# Altium project ad_Simu_Test.PrjPCB
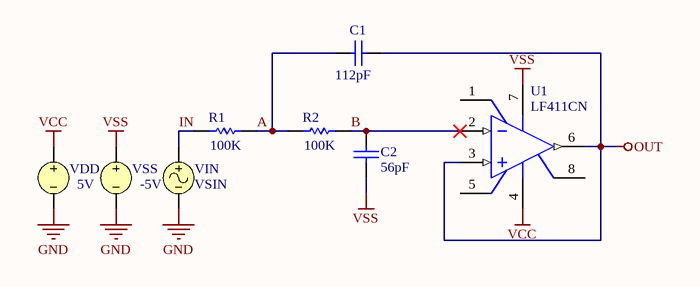
[diagram p0: ad_Simu_Test.SchDoc]
1 sheet, 8 parts. Net scope: global (net labels, ports and power ports of the same name join across sheets).

## Sheet ad_Simu_Test.SchDoc
size A4

### Parts
C1  value 112pF  [1608[0603]]  (hidden comment: Cap Semi)
C2  value 56pF  [1608[0603]]  (hidden comment: Cap Semi)
R1  value 100K  [AXIAL-0.5]  (hidden comment: Res Semi)
R2  value 100K  [AXIAL-0.5]  (hidden comment: Res Semi)
U1  LF411CN  [N08E]
VDD  value 5V  (hidden comment: VSRC)
VIN  VSIN
VSS  value -5V  (hidden comment: VSRC)

### Nets
GND: VDD.2 VIN.2 VSS.2
OUT: C1.2 U1.3(IN+) U1.6(OUT)
VCC: U1.4(V-) VDD.1
VSS: C2.1 U1.7(V+) VSS.1
A: C1.1 R1.2 R2.1
B: C2.2 R2.2 U1.2(IN-)
IN: R1.1 VIN.1

Not connected (* = marked no-connect by the designer): U1 1(BAL) 5(BAL) 8(NC)

### Library data of the parts
C1 C2 = Cap Semi: Capacitor (Semiconductor SIM Model); Published: 8-Jun-2000; LatestRevisionDate: 29-May-2009; LatestRevisionNote: IPC-7351 Footprint Added.; PackageReference: C1206; Publisher: Altium Limited; PackageDescription: Chip Capacitor
R1 R2 = Res Semi: Semiconductor Resistor; Published: 8-Jun-2000; LatestRevisionDate: 17-Jul-2002; LatestRevisionNote: Re-released for DXP Platform.; PackageReference: AXIAL-0.5; Publisher: Altium Limited; PackageDescription: Axial Device, Thru-Hole; 2 Leads; 0.5 in Pin Spacing
U1 = LF411CN: Low Offset, Low Drift JFET Input Operational Amplifier, 8-pin MDIP; Manufacturer: National Semiconductor; PackageTopMarking: NSUZXYTTE#*LF*411CN; PowerWise: N; CompType: Amplifiers; Published: 4-Dec-2008; LatestRevisionDate: 13-Jan-2009; LatestRevisionNote: Sim Model Added.; DatasheetVersion: Aug-2000; PackageVersion: revG, May-2006; PackageReference: N08E; Publisher: Altium Limited; PackageDescription: MDIP, .365 x .250 x .130in, 8 Lead, .100in Pitch; Supplier 1: Farnell; Supplier Part Number 1: 9487026; PartNumber: LF411CN; RoHS: N; PinCount: 8; Code_JEDEC: MS-001-BA; ComponentLink1Description: LF411 Datasheet; ComponentLink1URL: http://www.national.com/ds/LF/LF411.pdf; ComponentLink2Description: LF411 Web Page; ComponentLink2URL: http://www.national.com/pf/LF/LF411.html; ComponentLink3Description: N08E Package Page; ComponentLink3URL: http://www.national.com/packaging/folders/n08e.html
VDD VSS = VSRC: Voltage Source; Note: PCB Footprint - Not required; Published: 8-Jun-2000; LatestRevisionDate: 17-Jul-2002; LatestRevisionNote: Re-released for DXP Platform.; PackageReference: Not Applicable; Publisher: Altium Limited
VIN = VSIN: Sinusoidal Voltage Source; Note: PCB Footprint - Not required; Published: 8-Jun-2000; LatestRevisionDate: 15-Nov-2004; LatestRevisionNote: Corrected Netlist.; PackageReference: Not Applicable; Publisher: Altium Limited